# EAGLE design Custom Sheild-PCB (EAGLE 9.5.1)
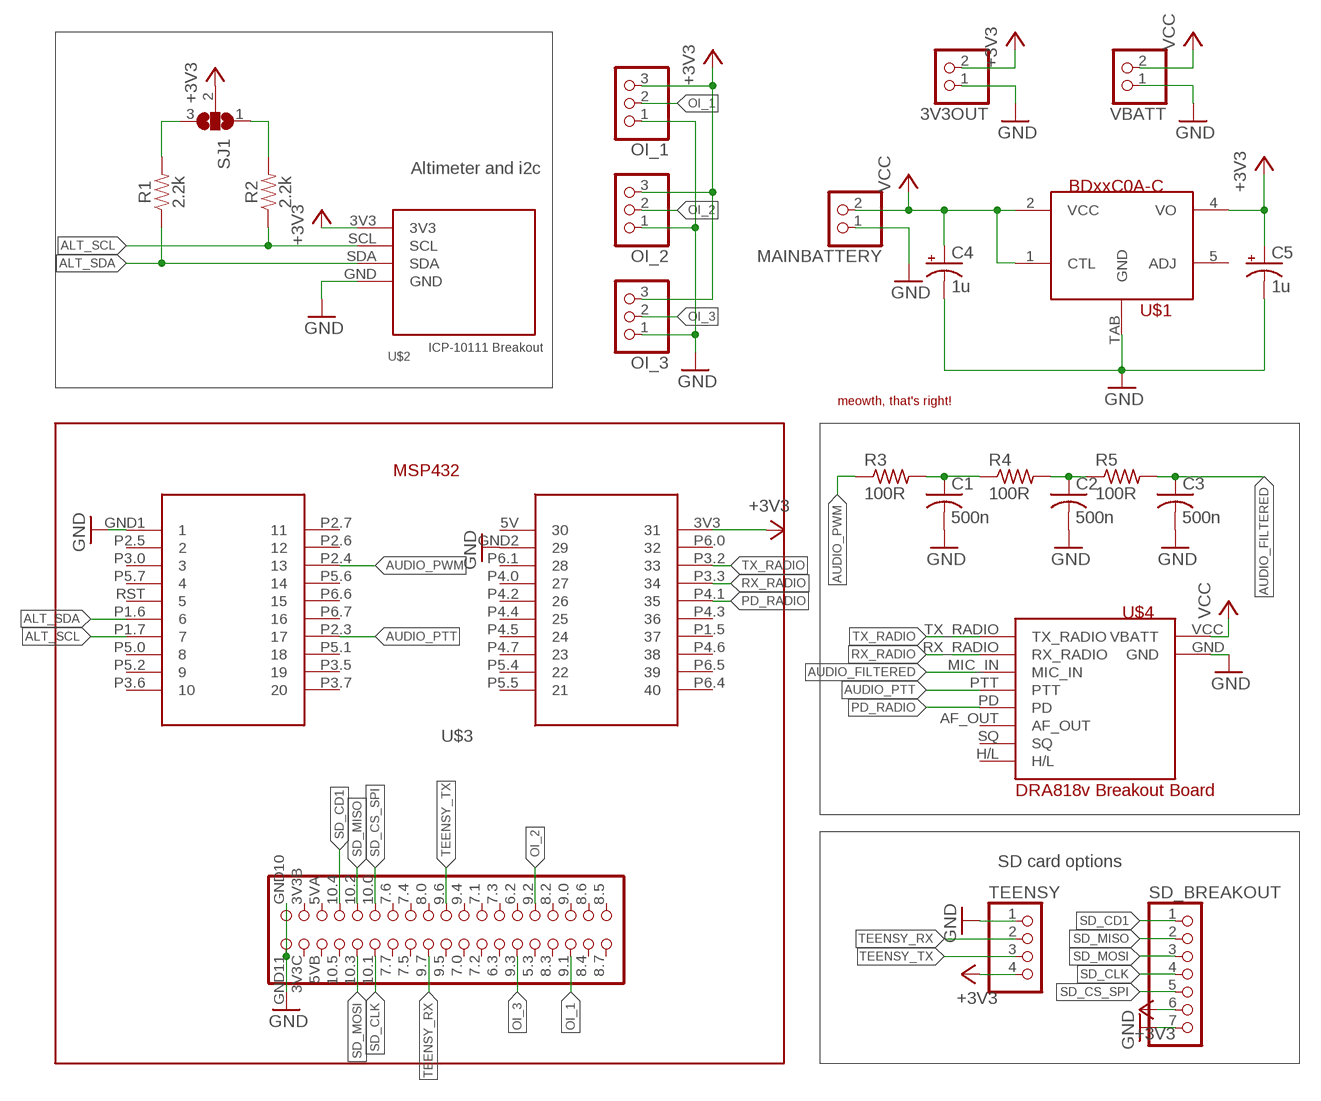
[diagram p0: schematic, sheet 1]

## Parts
3V3OUT  PINHD-1X2  [1X02]
C1  500n  C-USC0805  [C0805]
C2  500n  C-USC0805  [C0805]
C3  500n  C-USC0805  [C0805]
C4  1u  CPOL-USA  [PANASONIC_A]
C5  1u  CPOL-USA  [PANASONIC_A]
MAINBATTERY  PINHD-1X2  [1X02]
OI_1  PINHD-1X3  [1X03]
OI_2  PINHD-1X3  [1X03]
OI_3  PINHD-1X3  [1X03]
R1  2.2k  2.2KOHM-0603-1/10W-1%  [0603]
R2  2.2k  2.2KOHM-0603-1/10W-1%  [0603]
R3  100R  R-US_R0805  [R0805]
R4  100R  R-US_R0805  [R0805]
R5  100R  R-US_R0805  [R0805]
SD_BREAKOUT  PINHD-1X7  [1X07]
SJ1  SJ2W  [SJ_2]
TEENSY  PINHD-1X4  [1X04]
U$1  BDXXC0A-CBD33C0AWFP-CE2  [TO252-5-11]
U$2  ALTIMETER  [ALTIMETER]
U$3  MSP432  [MSP432]
U$4  DRA_BREAKOUT  [DRA_BREAKOUT]
U$5  MEOWTH  [MEOWTH]
VBATT  PINHD-1X2  [1X02]

## Nets
+3V3 [pwr]: 3V3OUT.2 C5.+ OI_1.3 OI_2.3 OI_3.3 SD_BREAKOUT.6 SJ1.2 TEENSY.4 U$1.4(VO) U$2.3V3 U$3.3V3
ALT_SCL: R2.1 U$2.SCL U$3.P1.7
ALT_SDA: R1.1 U$2.SDA U$3.P1.6
AUDIO_FILTERED: C3.1 R5.2 U$4.MIC_IN
AUDIO_PTT: U$3.P2.3 U$4.PTT
AUDIO_PWM: R3.1 U$3.P2.4
GND [pwr]: 3V3OUT.1 C1.2 C2.2 C3.2 C4.- C5.- MAINBATTERY.1 OI_1.1 OI_2.1 OI_3.1 SD_BREAKOUT.7 TEENSY.1 U$1.TAB(GND) U$2.GND U$3.GND1 U$3.GND2 U$3.GND10 U$3.GND11 U$4.GND VBATT.1
N$1: R1.2 SJ1.3
N$2: R2.2 SJ1.1
N$3: C1.1 R3.2 R4.1
N$4: C2.1 R4.2 R5.1
OI_1: OI_1.2 U$3.9.1
OI_2: OI_2.2 U$3.9.2
OI_3: OI_3.2 U$3.9.3
PD_RADIO: U$3.P4.1 U$4.PD
RX_RADIO: U$3.P3.3 U$4.RX_RADIO
SD_CD1: SD_BREAKOUT.1 U$3.10.4
SD_CLK: SD_BREAKOUT.4 U$3.10.1
SD_CS_SPI: SD_BREAKOUT.5 U$3.10.0
SD_MISO: SD_BREAKOUT.2 U$3.10.2
SD_MOSI: SD_BREAKOUT.3 U$3.10.3
TEENSY_RX: TEENSY.2 U$3.9.7
TEENSY_TX: TEENSY.3 U$3.9.6
TX_RADIO: U$3.P3.2 U$4.TX_RADIO
VCC [pwr]: C4.+ MAINBATTERY.2 U$1.1(CTL) U$1.2(VCC) U$4.VCC(VBATT) VBATT.2
Unconnected: U$1.5(ADJ) U$3.3V3B U$3.3V3C U$3.5.3 U$3.5VA U$3.5VB U$3.6.2 U$3.6.3 U$3.7.0 U$3.7.1 U$3.7.2 U$3.7.3 U$3.7.4 U$3.7.5 U$3.7.6 U$3.7.7 U$3.8.0 U$3.8.2 U$3.8.3 U$3.8.4 U$3.8.5 U$3.8.6 U$3.8.7 U$3.9.0 U$3.9.4 U$3.9.5 U$3.10.5 U$3.P1.5 U$3.P2.5 U$3.P2.6 U$3.P2.7 U$3.P3.0 U$3.P3.5 U$3.P3.6 U$3.P3.7 U$3.P4.0 U$3.P4.2 U$3.P4.3 U$3.P4.4 U$3.P4.5 U$3.P4.6 U$3.P4.7 U$3.P5.0 U$3.P5.1 U$3.P5.2 U$3.P5.4 U$3.P5.5 U$3.P5.6 U$3.P5.7 U$3.P6.0 U$3.P6.1 U$3.P6.4 U$3.P6.5 U$3.P6.6 U$3.P6.7 U$3.RST U$4.AF_OUT U$4.H/L U$4.SQ

## Notes on the sheet
- Altimeter and i2c
- SD card options

## Power pins joined to a net without a drawn wire
30: U$3.5V

## Library data of the parts
3V3OUT MAINBATTERY VBATT = pinhead:PINHD-1X2: PIN HEADER
C1-C3 = rcl:C-US: CAPACITOR, American symbol; SPICEPREFIX: C
C4 C5 = rcl:CPOL-US: POLARIZED CAPACITOR, American symbol; SPICEPREFIX: C
OI_1-OI_3 = pinhead:PINHD-1X3: PIN HEADER
R1 R2 = SparkFun-Resistors:2.2KOHM: 2.2kΩ resistor A resistor is a passive two-terminal electrical component that implements electrical resistance as a circuit element. Resistors act to reduce current flow, and, at the same time, act to lower voltage levels within circuits. - Wikipedia; PROD_ID: RES-08272
R3-R5 = rcl:R-US_: RESISTOR, American symbol; SPICEPREFIX: R
SD_BREAKOUT = pinhead:PINHD-1X7: PIN HEADER
SJ1 = jumper:SJ2W: SMD solder JUMPER
TEENSY = pinhead:PINHD-1X4: PIN HEADER
U$1 = Custom Library:BDXXC0A-C
U$2 = Custom Library:ALTIMETER
U$3 = Custom Library:MSP432
U$4 = Custom Library:DRA_BREAKOUT
U$5 = Custom Library:MEOWTH

## Net classes
0 default: width 0.152 mm, drill 0.152 mm, clearance 0.254 mm
1 pwr: width 0.889 mm, drill 0.152 mm, clearance 0.381 mm

## Board
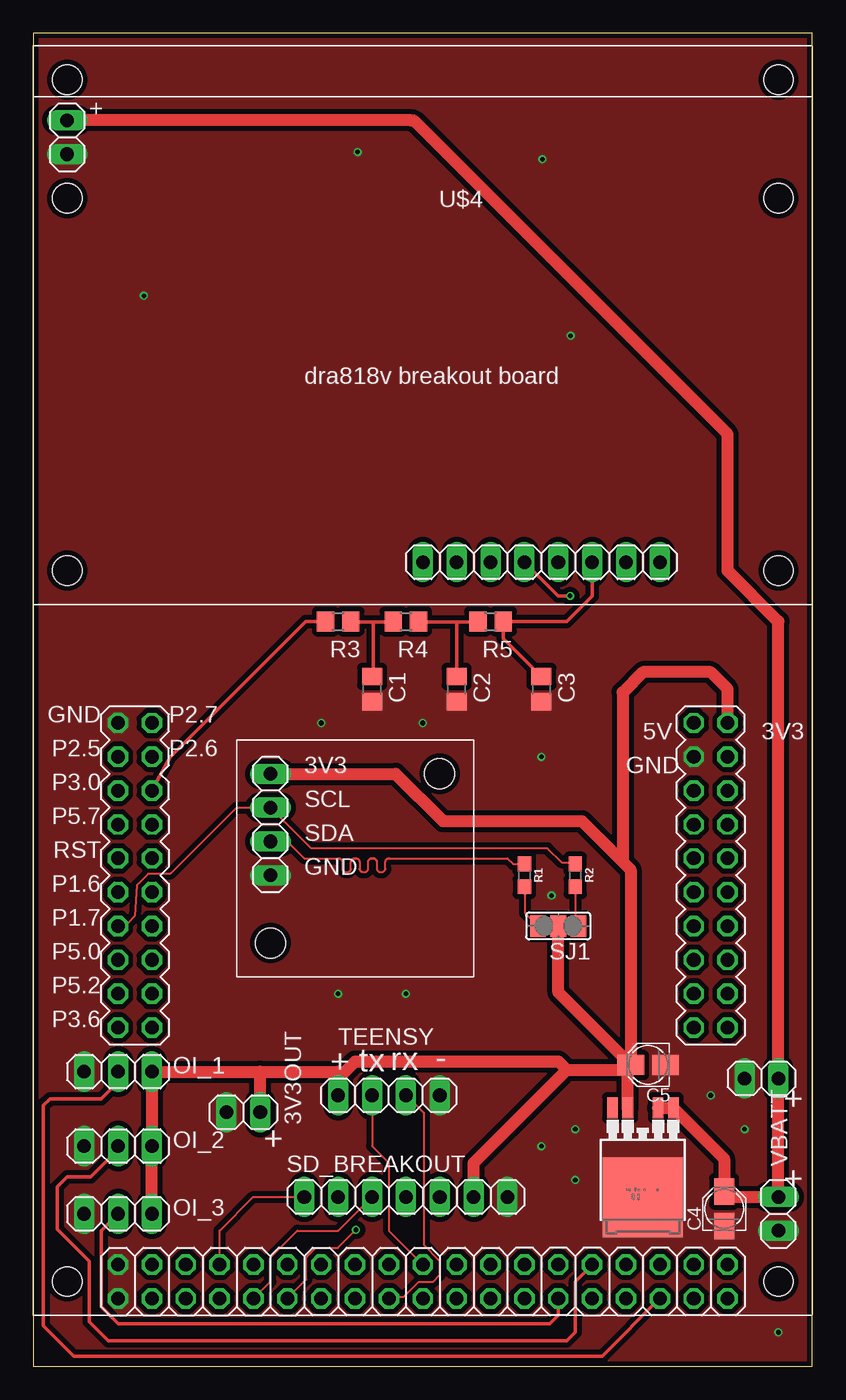
[diagram p1: board, top side]
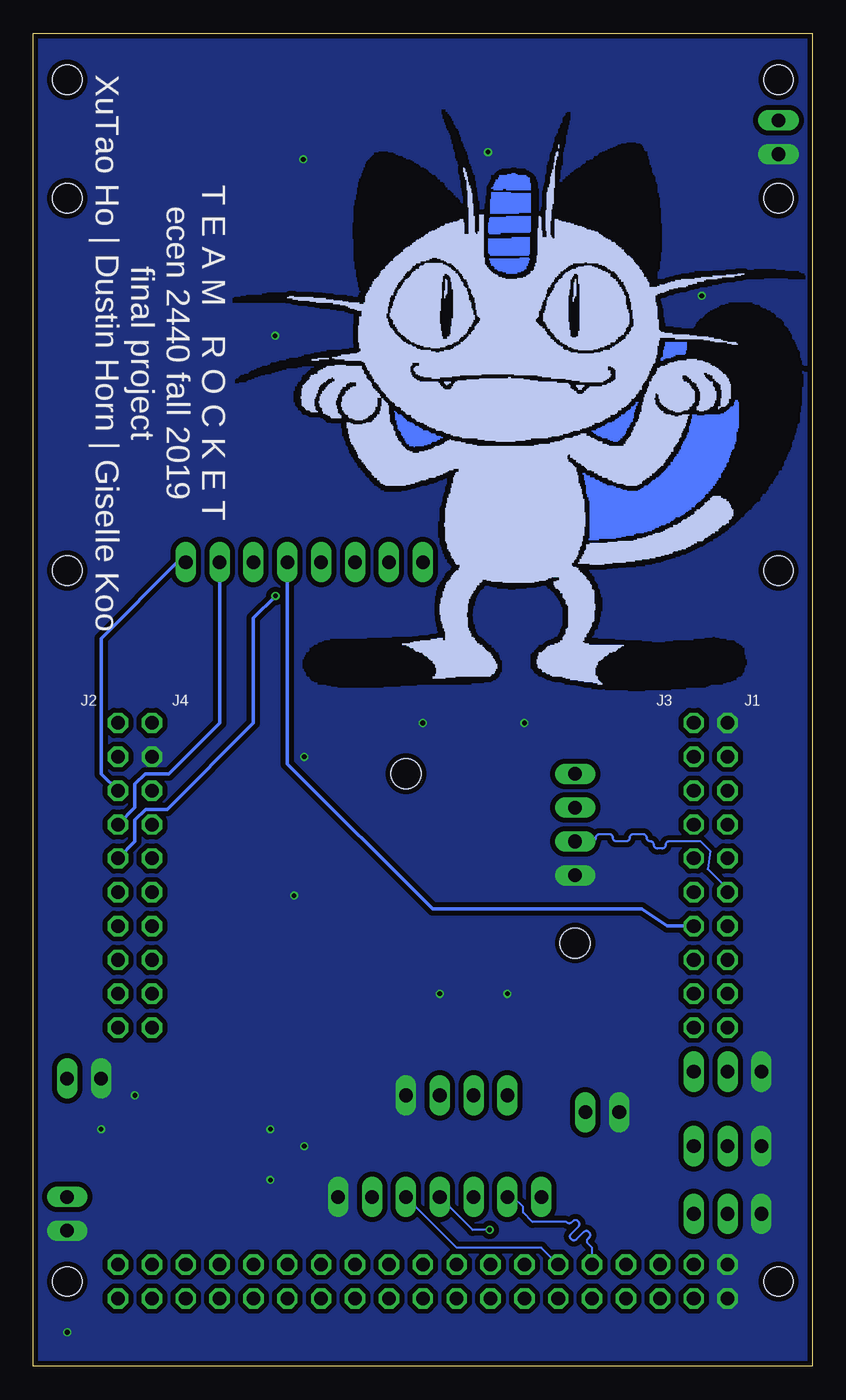
[diagram p2: board, bottom side, seen from below]

Size 58.42 x 100 mm. Coordinates in mm from the lower left corner, seen from the top.
Outline: 0,0 58.42,0 58.42,100 0,100 0,0
Copper layers (1*16): Top 0.035559375mm / dielectric 1.6mm / Bottom 0.035559375mm
Design rules "oshpark-2layer *": minimum track width 6mil, minimum drill 10mil, track to track 6mil, track to pad 6mil, pad to pad 6mil, via to via 6mil, smd to smd 6mil, copper to edge 15mil, drill to drill 6mil, minimum pad ring 5mil, minimum via ring 5mil, stop-mask expansion 2.5mil, vias tented up to drill 0mil, thermal gap 10mil

### Footprints (pad centres in the part's own frame; a part is rotated, then mirrored left to right if it is on the bottom)
1X02 = drill 1.016 long: 1 -1.27,0; 2 1.27,0
C0805 = smd 1.3 x 1.5: 1 -0.95,0; 2 0.95,0
PANASONIC_A = smd 2 x 1.5: + 1.3,0; - -1.3,0
1X03 = drill 1.016 long: 1 -2.54,0; 2 0,0; 3 2.54,0
0603 = smd 1.1 x 1: 1 -0.85,0; 2 0.85,0
R0805 = smd 1.3 x 1.5: 1 -0.95,0; 2 0.95,0
1X07 = drill 1.016 long: 1 -7.62,0; 2 -5.08,0; 3 -2.54,0; 4 0,0; 5 2.54,0; 6 5.08,0; 7 7.62,0
SJ_2 = smd 1.168 x 1.6: 1 -1.524,0; 2 0,0; 3 1.524,0
1X04 = drill 1.016 long: 1 -3.81,0; 2 -1.27,0; 3 1.27,0; 4 3.81,0
TO252-5-11 = smd 0.8 x 1.6: 1 -2.28,-5.41; 2 -1.14,-5.41; 4 1.14,-5.41; 5 2.28,-5.41 | smd 6 x 6: TAB 0,1.3
ALTIMETER = drill 1.016 long: 3V3 2.54,15.24; GND 2.54,7.62; SCL 2.54,12.7; SDA 2.54,10.16 | hole 2.261: 2.54,2.54; 15.24,15.24
MSP432 = drill 1.016 octagon: 3V3 52.07,44.45; 3V3B 8.89,3.81; 3V3C 8.89,1.27; 5.3 41.91,1.27; 5V 49.53,44.45; 5VA 11.43,3.81; 5VB 11.43,1.27; 6.2 39.37,3.81; 6.3 36.83,1.27; 7.0 31.75,1.27; 7.1 34.29,3.81; 7.2 34.29,1.27; 7.3 36.83,3.81; 7.4 24.13,3.81; 7.5 24.13,1.27; 7.6 21.59,3.81; 7.7 21.59,1.27; 8.0 26.67,3.81; 8.2 44.45,3.81; 8.3 44.45,1.27; 8.4 46.99,3.81; 8.5 52.07,3.81; 8.6 52.07,1.27; 8.7 49.53,1.27; 9.0 49.53,3.81; 9.1 46.99,1.27; 9.2 41.91,3.81; 9.3 39.37,1.27; 9.4 31.75,3.81; 9.5 29.21,1.27; 9.6 29.21,3.81; 9.7 26.67,1.27; 10.0 19.05,3.81; 10.1 19.05,1.27; 10.2 16.51,3.81; 10.3 16.51,1.27; 10.4 13.97,3.81; 10.5 13.97,1.27; GND1 6.35,44.45; GND2 49.53,41.91; GND10 6.35,3.81; GND11 6.35,1.27; P1.5 52.07,29.21; P1.6 6.35,31.75; P1.7 6.35,29.21; P2.3 8.89,29.21; P2.4 8.89,39.37; P2.5 6.35,41.91; P2.6 8.89,41.91; P2.7 8.89,44.45; P3.0 6.35,39.37; P3.2 52.07,39.37; P3.3 52.07,36.83; P3.5 8.89,24.13; P3.6 6.35,21.59; P3.7 8.89,21.59; P4.0 49.53,36.83; P4.1 52.07,34.29; P4.2 49.53,34.29; P4.3 52.07,31.75; P4.4 49.53,31.75; P4.5 49.53,29.21; P4.6 52.07,26.67; P4.7 49.53,26.67; P5.0 6.35,26.67; P5.1 8.89,26.67; P5.2 6.35,24.13; P5.4 49.53,24.13; P5.5 49.53,21.59; P5.6 8.89,36.83; P5.7 6.35,36.83; P6.0 52.07,41.91; P6.1 49.53,39.37; P6.4 52.07,21.59; P6.5 52.07,24.13; P6.6 8.89,34.29; P6.7 8.89,31.75; RST 6.35,34.29 | hole 2.21: 2.54,92.71; 55.88,92.71; 2.54,2.54; 55.88,2.54
DRA_BREAKOUT = drill 1.016 long: AF_OUT 34.29,3.175; GND 2.54,33.782; H/L 29.21,3.175; MIC_IN 41.91,3.175; PD 36.83,3.175; PTT 39.37,3.175; RX_RADIO 44.45,3.175; SQ 31.75,3.175; TX_RADIO 46.99,3.175; VCC 2.54,36.322 | hole 2.21: 55.88,30.48; 55.88,2.54; 2.54,2.54; 2.54,30.48

### Placement (x,y rotation side)
3V3OUT  15.75,19.05 0 top
C1  25.4,50.8 270 top
C2  31.75,50.8 270 top
C3  38.1,50.8 270 top
C4  51.82,11.81 90 top
C5  46.1,22.61 180 top
MAINBATTERY  55.88,11.43 90 top
OI_1  6.35,22.1 0 top
OI_2  6.35,16.51 0 top
OI_3  6.35,11.43 0 top
R1  36.83,36.83 270 top
R2  40.64,36.83 270 top
R3  22.86,55.88 0 top
R4  27.94,55.88 0 top
R5  34.29,55.88 0 top
SD_BREAKOUT  27.94,12.7 0 top
SJ1  39.37,33.02 180 top
TEENSY  26.67,20.32 180 top
U$1  45.72,13.97 180 top
U$2  15.24,29.21 0 top
U$3  0,3.81 0 top
U$4  0,57.15 0 top
U$5  22.19,52.34 0 bottom
VBATT  54.61,21.59 0 top

### Tracks (layer width: path | path; a pad name or v marks a point on that pad's centre or on a via)
+3V3
  Top 0.889: U$1.4 44.58,22.39 C5.+ | C5.+ 39.37,28.04 SJ1.2 | OI_3.3 OI_2.3 OI_1.3 17.02,22.1 | 17.02,22.1 22.86,22.1 TEENSY.4 22.86,21.59 24.13,22.86 39.37,22.86 40.01,22.23 | SD_BREAKOUT.6 33.02,15.24 40.01,22.23 | U$2.3V3 27.18,44.45 30.73,40.89 41.15,40.89 44.2,37.85 | 44.2,37.85 44.8,37.24 C5.+ | U$3.3V3 52.07,50.8 50.8,52.07 45.72,52.07 44.2,50.55 44.2,37.85 | 3V3OUT.2 17.02,22.1 | 40.01,22.23 44.42,22.23 C5.+
ALT_SCL
  Top 0.152: R2.1 40.54,37.8 39.62,37.8 38.56,38.86 20.83,38.86 U$2.SCL 15.24,41.91 10.26,36.93 8.61,36.93 7.76,36.08 7.62,33.78 7.11,33.27 6.6,33.27 U$3.P1.7
ALT_SDA
  Top 0.152: U$2.SDA 19.05,39.37 20.32,38.1 22.91,38.1 arc-90 23.17,37.83 23.17,37.34 arc90 23.44,37.07 23.55,37.07 arc90 23.82,37.34 23.82,37.83 arc-90 24.09,38.1 24.2,38.1 arc-90 24.47,37.83 24.47,37.34 arc90 24.73,37.07 24.84,37.07 arc90 25.11,37.34 25.11,37.83 arc-90 25.38,38.1 25.49,38.1 arc-90 25.76,37.83 25.76,37.34 arc90 26.02,37.07 26.14,37.07 arc90 26.4,37.34 26.4,37.83 arc-90 26.67,38.1 35.56,38.1 35.98,37.68 R1.1
  Bottom 0.152: U$3.P1.6 6.35,35.81 7.84,37.31 7.65,38.64 8.38,39.37 10.74,39.37 arc-90 11,39.1 arc90 11.27,38.84 11.61,38.84 arc90 11.88,39.1 arc-90 12.14,39.37 arc90 12.41,39.64 arc-90 12.68,39.9 13.44,39.9 arc-90 13.7,39.64 arc90 13.97,39.37 14.68,39.37 arc90 14.95,39.64 arc-90 15.21,39.9 15.98,39.9 arc-90 16.24,39.64 arc90 16.51,39.37 U$2.SDA
AUDIO_FILTERED
  Top 0.152: 35.26,55.83 R5.2 | 38,51.87 C3.1
  Top 0.254: 35.26,55.83 35.26,54.61 38,51.87 | R5.2 40.01,55.88 41.91,57.78 U$4.MIC_IN
AUDIO_PTT
  Bottom 0.254: U$3.P2.3 10.89,33.02 12.79,34.29 28.48,34.29 39.37,45.18 U$4.PTT
AUDIO_PWM
  Top 0.254: R3.1 20.42,55.88 10.26,45.72 U$3.P2.4
GND  (via drill 0.35)
  other vias: 27.94,27.94 22.86,27.94 8.29,80.31 38.18,90.55 38.86,35.31 24.32,91.09 38.1,45.72 29.21,48.26 21.59,48.26 40.64,13.97 55.88,2.54 40.64,17.78 38.1,16.51 53.34,17.78 50.8,20.32 40.29,77.31
  pour Bottom (no thermals): 0,100 0,0 58.42,0 58.42,100
  pour Top (no thermals): 0,100 0,0 58.42,0 58.42,100
N$1
  Top 0.152: SJ1.3 36.88,33.98 36.88,35.97 R1.2
N$2
  Top 0.152: SJ1.1 40.69,33.22 40.69,35.97 R2.2
N$3
  Top 0.152: 23.82,55.83 R3.2 | 26.87,55.83 R4.1 | 25.5,51.87 C1.1
  Top 0.254: 26.87,55.83 25.5,55.83 | 25.5,55.83 23.82,55.83 | 25.5,55.83 25.5,51.87
N$4
  Top 0.152: 29.01,55.83 R4.2 | 33.27,55.83 R5.1
  Top 0.254: 33.27,55.83 31.75,55.83 | 31.75,55.83 29.01,55.83 | 31.75,55.83 C2.1
OI_1
  Top 0.254: U$3.9.1 42.67,0.76 3.05,0.76 0.76,3.05 0.76,19.56 1.27,20.07 5.08,20.07 6.35,21.34 OI_1.2
OI_2
  Top 0.254: U$3.9.2 40.64,6.35 40.64,2.54 40.01,1.91 5.63,1.91 4.19,3.35 4.19,7.87 1.78,10.29 1.78,13.46 2.54,14.22 4.32,14.22 6.35,16.26 OI_2.2
OI_3
  Top 0.254: U$3.9.3 39.37,3.81 38.73,3.17 6.35,3.17 5.08,4.45 5.08,10.16 OI_3.2
PD_RADIO  (via drill 0.35)
  Top 0.254: v40.26,57.79 39.37,57.79 U$4.PD
  Bottom 0.254: v40.26,57.79 41.91,56.13 41.91,48.26 48.39,41.78 50,41.78 50.8,40.99 50.8,39.37 U$3.P4.1
RX_RADIO
  Bottom 0.254: U$4.RX_RADIO 44.45,48.26 48.26,44.45 50.04,44.45 50.8,43.69 50.8,41.91 U$3.P3.3
SD_CD1
  Top 0.152: U$3.10.4 13.97,10.16 16.51,12.7 SD_BREAKOUT.1
SD_CLK  (via drill 0.35)
  Top 0.152: U$3.10.1 20.47,6.5 20.47,8.16 21.18,8.87 22.84,8.87 v24.2,10.23
  Bottom 0.152: v24.2,10.23 25.47,10.23 SD_BREAKOUT.4
SD_CS_SPI
  Bottom 0.152: U$3.10.0 20.32,8.89 26.67,8.89 SD_BREAKOUT.5
SD_MISO
  Bottom 0.152: U$3.10.2 16.51,8.89 16.81,9.19 arc90 16.81,9.57 16.73,9.66 arc-90 16.73,10.04 16.76,10.07 arc-90 17.13,10.07 17.69,9.51 arc90 18.06,9.51 18.09,9.54 arc90 18.09,9.92 17.54,10.47 arc-90 17.54,10.85 17.57,10.88 arc-90 17.95,10.88 18.04,10.79 arc90 18.41,10.79 18.44,10.82 20.98,10.82 21.69,11.53 21.69,11.94 22.45,12.7 SD_BREAKOUT.2
SD_MOSI
  Top 0.152: U$3.10.3 17.78,6.35 17.78,8.13 19.81,10.16 22.86,10.16 SD_BREAKOUT.3
TEENSY_RX
  Top 0.152: U$3.9.7 26.67,5.18 27.76,5.18 28.88,6.3 29.95,6.3 30.45,6.81 30.45,7.92 29.29,9.09 29.29,19.02 28.04,20.27 TEENSY.2
TEENSY_TX
  Top 0.152: TEENSY.3 25.4,16.51 26.67,15.24 26.67,10.16 U$3.9.6
TX_RADIO
  Bottom 0.254: U$3.P3.2 53.34,44.45 53.34,54.61 47.62,60.33 U$4.TX_RADIO
VCC
  Top 0.889: U$4.VCC 28.29,93.47 28.56,93.44 52.07,69.93 52.07,59.69 55.88,55.88 VBATT.2 MAINBATTERY.2 52.23,12.7 C4.+ 51.82,15.56 U$1.1 U$1.2

### Text on the board
tPlace: + | tx | rx | - | + | + | +
bPlace: T E A M R O C K E T / ecen 2440 fall 2019 / final project / XuTao Ho | Dustin Horn | Giselle Koo